# EAGLE board BKU (EAGLE 9.4.2)
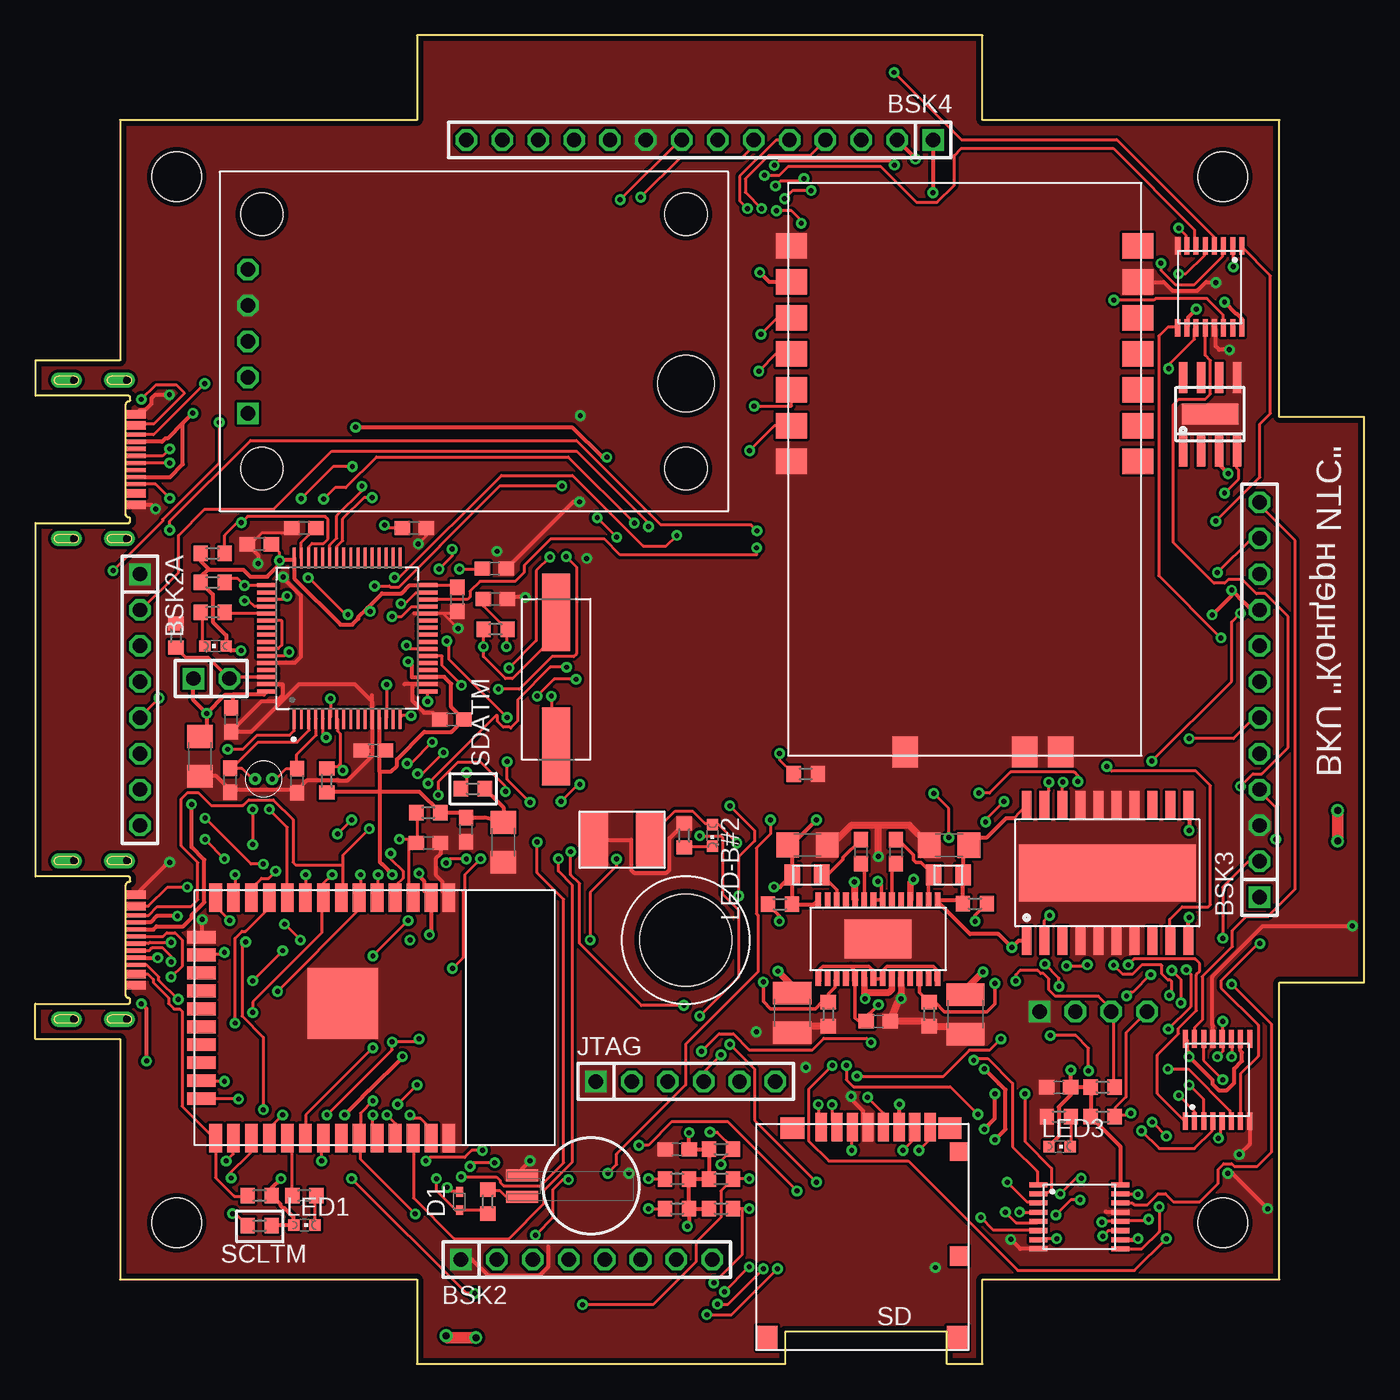
[diagram p2: board, top side]
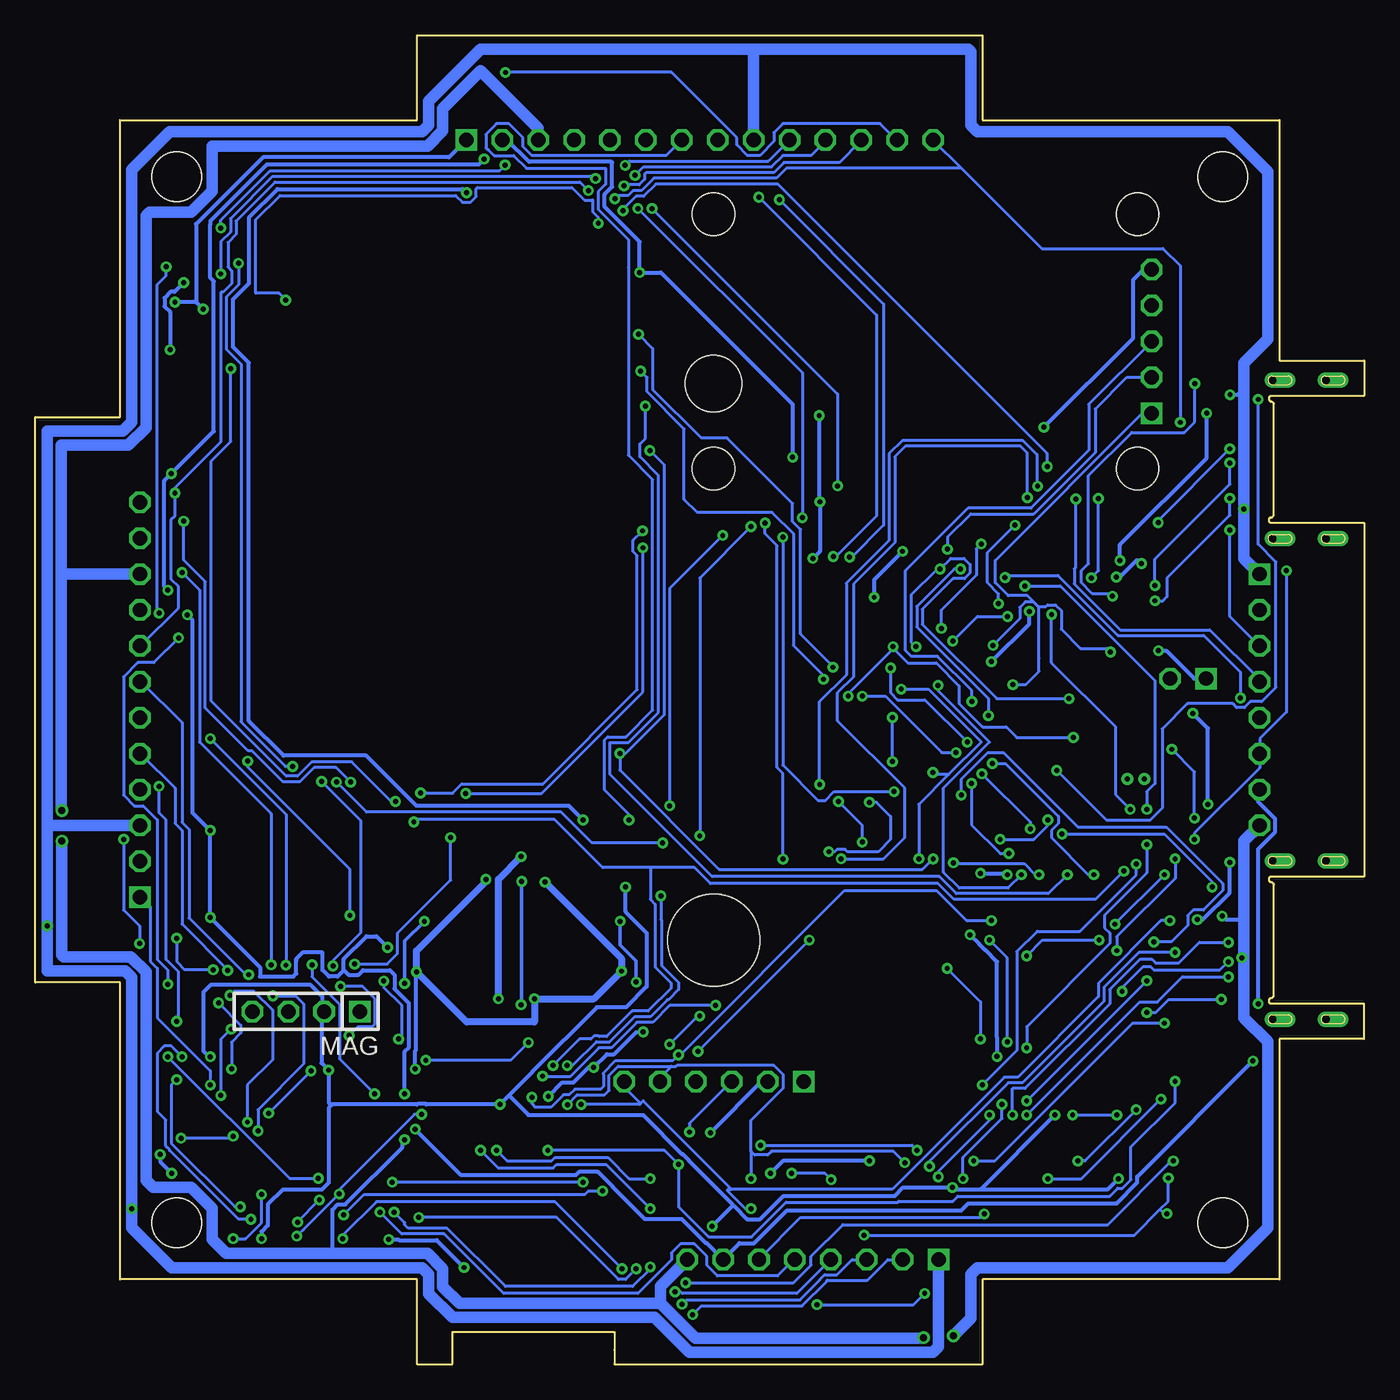
[diagram p3: board, bottom side, seen from below]

Size 94 x 94 mm. Coordinates in mm from the lower left corner, seen from the top.
Outline: 0,68.5 0,71 6,71 6,88 27,88 27,94 67,94 67,88 88,88 88,67 94,67 94,27 88,27 88,6 67,6 67,0 64.5,0 64.5,1
Outline: 0,59.5 0,34.5
Outline: 0,25.5 0,23 6,23 6,6 27,6 27,0 53.04,0 53.04,1
Copper layers (1*16): Top 0.035mm / dielectric 1.5mm / Bottom 0.035mm
Design rules "default *": minimum track width 0.2mm, minimum drill 0.35mm, track to track 0.2mm, track to pad 0.2mm, pad to pad 0.2mm, via to via 0.2mm, smd to smd 0.2mm, copper to edge 0.35mm, drill to drill 0.1mm, minimum pad ring 10mil, minimum via ring 8mil, stop-mask expansion 2mil, vias tented up to drill 0mil, thermal gap 10mil
Holes 3.5 mm at 10,10 84,84 10,84 84,10
Holes 6.5 mm at 46,30

## Footprints (pad centres in the part's own frame; a part is rotated, then mirrored left to right if it is on the bottom)
1X08 = drill 1.016 square: 1 -8.89,0 | drill 1.016 octagon: 2 -6.35,0; 3 -3.81,0; 4 -1.27,0; 5 1.27,0; 6 3.81,0; 7 6.35,0; 8 8.89,0
1X12 = drill 1.016 square: 1 -13.97,0 | drill 1.016 octagon: 2 -11.43,0; 3 -8.89,0; 4 -6.35,0; 5 -3.81,0; 6 -1.27,0; 7 1.27,0; 8 3.81,0; 9 6.35,0; 10 8.89,0; 11 11.43,0; 12 13.97,0
1X14 = drill 1.016 square: 1 -16.51,0 | drill 1.016 octagon: 2 -13.97,0; 3 -11.43,0; 4 -8.89,0; 5 -6.35,0; 6 -3.81,0; 7 -1.27,0; 8 1.27,0; 9 3.81,0; 10 6.35,0; 11 8.89,0; 12 11.43,0; 13 13.97,0; 14 16.51,0
BATTCON-6.8MM = smd 2.25 x 0.85: + 4.87,0.75; - 4.87,-0.75
C0603 = smd 1.1 x 1: 1 -0.85,0; 2 0.85,0
C1206 = smd 1.6 x 1.8: 1 -1.4,0; 2 1.4,0
C1210 = smd 1.6 x 2.7: 1 -1.4,0; 2 1.4,0
SOD523 = smd 0.7 x 0.5: A 0.7,0; C -0.6,0
GPS-NEO6M = drill 1.016 square: P$1 -5.08,16 | drill 1.016 octagon: P$2 -2.54,16; P$3 0,16; P$4 2.54,16; P$5 5.08,16 | hole 3: -9,15; 9,15; -9,-15; 9,-15 | hole 4: -3,-15
1X02 = drill 1.016 square: 1 -1.27,0 | drill 1.016 octagon: 2 1.27,0
1X06 = drill 1.016 square: 1 -6.35,0 | drill 1.016 octagon: 2 -3.81,0; 3 -1.27,0; 4 1.27,0; 5 3.81,0; 6 6.35,0
CHIPLED_0603 = smd 0.8 x 0.8: A 0,-0.75; C 0,0.75
1X04 = drill 1.016 square: 1 -3.81,0 | drill 1.016 octagon: 2 -1.27,0; 3 1.27,0; 4 3.81,0
XTAL_9C-8.000MEEJ-T = smd 5.5 x 2: 1 -4.75,0; 2 4.75,0
C005R = drill 0.35 pad 0.85: P$1 0,0.6; P$2 0,-0.6
R0603 = smd 1 x 1.1: 1 -0.85,0; 2 0.85,0
RADIO = smd 2.2 x 1.8: P$1 -24.75,20.8; P$2 -24.75,23.34; P$3 -24.75,25.88; P$4 -24.75,28.42; P$5 -24.75,30.96; P$6 -24.75,33.5; P$7 -24.75,36.04; P$8 -0.25,36.04; P$9 -0.25,33.5; P$10 -0.25,30.96; P$11 -0.25,28.42; P$12 -0.25,25.88; P$13 -0.25,23.34; P$14 -0.25,20.8 | smd 1.8 x 2.2: P$15 -5.73,0.25; P$16 -8.27,0.25; P$17 -16.73,0.25
SD = smd 0.8 x 2: CLK 6,-15.77; CMD 8.2,-15.77; DAT0 3.8,-15.77; DAT1 2.7,-15.77; DAT2 10.4,-15.77; DAT3 9.3,-15.77; VDD 7.1,-15.77; VSS 4.9,-15.77 | smd 1.5 x 1.7: P$9 0.75,-0.85; P$13 14.25,-0.85 | smd 1.6 x 1.5: P$10 1.3,-15.7 | smd 1.29 x 1.3: P$11 0.645,-14.05 | smd 1.29 x 1.4: P$12 0.645,-6.65 | smd 1.7 x 1.5: P$14 12.45,-15.7
QFP50P1200X1200X160-64N = smd 1.47 x 0.28: 1 -5.67,3.75; 2 -5.67,3.25; 3 -5.67,2.75; 4 -5.67,2.25; 5 -5.67,1.75; 6 -5.67,1.25; 7 -5.67,0.75; 8 -5.67,0.25; 9 -5.67,-0.25; 10 -5.67,-0.75; 11 -5.67,-1.25; 12 -5.67,-1.75; 13 -5.67,-2.25; 14 -5.67,-2.75; 15 -5.67,-3.25; 16 -5.67,-3.75; 33 5.67,-3.75; 34 5.67,-3.25; 35 5.67,-2.75; 36 5.67,-2.25; 37 5.67,-1.75; 38 5.67,-1.25; 39 5.67,-0.75; 40 5.67,-0.25; 41 5.67,0.25; 42 5.67,0.75; 43 5.67,1.25; 44 5.67,1.75; 45 5.67,2.25; 46 5.67,2.75; 47 5.67,3.25; 48 5.67,3.75 | smd 0.28 x 1.47: 17 -3.75,-5.67; 18 -3.25,-5.67; 19 -2.75,-5.67; 20 -2.25,-5.67; 21 -1.75,-5.67; 22 -1.25,-5.67; 23 -0.75,-5.67; 24 -0.25,-5.67; 25 0.25,-5.67; 26 0.75,-5.67; 27 1.25,-5.67; 28 1.75,-5.67; 29 2.25,-5.67; 30 2.75,-5.67; 31 3.25,-5.67; 32 3.75,-5.67; 49 3.75,5.67; 50 3.25,5.67; 51 2.75,5.67; 52 2.25,5.67; 53 1.75,5.67; 54 1.25,5.67; 55 0.75,5.67; 56 0.25,5.67; 57 -0.25,5.67; 58 -0.75,5.67; 59 -1.25,5.67; 60 -1.75,5.67; 61 -2.25,5.67; 62 -2.75,5.67; 63 -3.25,5.67; 64 -3.75,5.67
USB-C = smd 0.3 x 1.4: 3V3/BUS0 -1.25,7.1; 3V3/BUS1 1.25,7.1; NC/3V3 -0.75,7.1; NC/M1 0.75,7.1; RX0 -1.75,7.1; SWC/TXD 0.25,7.1; SWD/RXD -0.25,7.1; TX0 1.75,7.1 | smd 0.6 x 1.4: GND0 -3.2,7.1; GND1 3.2,7.1; NC/GPIO 2.4,7.1; NRST/EN -2.4,7.1 | drill 0.6 pad 1.1 offset: P$13 -5.6,6.5; P$14 -5.6,2.75; P$15 5.6,6.5; P$16 5.6,2.75
DS18B20Z = smd 0.6 x 2.2: 1 -1.905,-2.6; 2 -0.635,-2.6; 3 0.635,-2.6; 4 1.905,-2.6; 5 1.905,2.6; 6 0.635,2.6; 7 -0.635,2.6; 8 -1.905,2.6 | smd 4 x 1.5: HEAT 0,0
EM_HEAT = smd 2 x 4: 1 -2,0; 2 2,0
L293DD = smd 0.7 x 2: 1 -5.715,-4.8; 2 -4.445,-4.8; 3 -3.175,-4.8; 4 -1.905,-4.8; 5 -0.635,-4.8; 6 0.635,-4.8; 7 1.905,-4.8; 8 3.175,-4.8; 9 4.445,-4.8; 10 5.715,-4.8; 11 5.715,4.8; 12 4.445,4.8; 13 3.175,4.8; 14 1.905,4.8; 15 0.635,4.8; 16 -0.635,4.8; 17 -1.905,4.8; 18 -3.175,4.8; 19 -4.445,4.8; 20 -5.715,4.8 | smd 12.5 x 4: HEAT 0,0
LTC3633 = smd 0.4 x 1.05: 1 -4.225,-2.775; 2 -3.575,-2.775; 3 -2.925,-2.775; 4 -2.275,-2.775; 5 -1.625,-2.775; 6 -0.975,-2.775; 7 -0.325,-2.775; 8 0.325,-2.775; 9 0.975,-2.775; 10 1.625,-2.775; 11 2.275,-2.775; 12 2.925,-2.775; 13 3.575,-2.775; 14 4.225,-2.775; 15 4.225,2.775; 16 3.575,2.775; 17 2.925,2.775; 18 2.275,2.775; 19 1.625,2.775; 20 0.975,2.775; 21 0.325,2.775; 22 -0.325,2.775; 23 -0.975,2.775; 24 -1.625,2.775; 25 -2.275,2.775; 26 -2.925,2.775; 27 -3.575,2.775; 28 -4.225,2.775 | smd 4.75 x 2.74: HEAT 0,0
B82498F = smd 1.1 x 1.5: 1 -1.05,0; 2 1.05,0
ESP32WROOM = smd 2 x 0.9: 1 -8.5,5.26; 2 -8.5,3.99; 3 -8.5,2.72; 4 -8.5,1.45; 5 -8.5,0.18; 6 -8.5,-1.09; 7 -8.5,-2.36; 8 -8.5,-3.63; 9 -8.5,-4.9; 10 -8.5,-6.17; 11 -8.5,-7.44; 12 -8.5,-8.71; 13 -8.5,-9.98; 14 -8.5,-11.25; 25 8.5,-11.25; 26 8.5,-9.98; 27 8.5,-8.71; 28 8.5,-7.44; 29 8.5,-6.17; 30 8.5,-4.9; 31 8.5,-3.63; 32 8.5,-2.36; 33 8.5,-1.09; 34 8.5,0.18; 35 8.5,1.45; 36 8.5,2.72; 37 8.5,3.99; 38 8.5,5.26 | smd 0.9 x 2: 15 -5.715,-12.25; 16 -4.445,-12.25; 17 -3.175,-12.25; 18 -1.905,-12.25; 19 -0.635,-12.25; 20 0.635,-12.25; 21 1.905,-12.25; 22 3.175,-12.25; 23 4.445,-12.25; 24 5.715,-12.25 | smd 5.01 x 5.01: HEAT -1.01,-2.24
74HC595 = smd 1.26 x 0.36: 1 -2.9,2.275; 2 -2.9,1.625; 3 -2.9,0.975; 4 -2.9,0.325; 5 -2.9,-0.325; 6 -2.9,-0.975; 7 -2.9,-1.625; 8 -2.9,-2.275; 9 2.9,-2.275; 10 2.9,-1.625; 11 2.9,-0.975; 12 2.9,-0.325; 13 2.9,0.325; 14 2.9,0.975; 15 2.9,1.625; 16 2.9,2.275

## Placement (x,y rotation side)
BSK2  [1X08]  39,7.4 0 top
BSK2A  [1X08]  7.4,47 270 top
BSK3  [1X12]  86.6,47 90 top
BSK4  [1X14]  47,86.6 180 top
BT1  6.8MM_COIN_CELL  [BATTCON-6.8MM]  39.31,12.6 180 top
C1  0,1µ  [C0603]  60.88,36.24 90 top
C2  100nF  [C0603]  72.4,19.6 180 top
C3  10µ  [C1206]  33.11,36.92 270 top
C4  1nF  [C0603]  27.81,36.86 0 top
C5  0,1µ  [C0603]  58.4,36.24 270 top
C6  22µ  [C1206]  54.62,36.73 0 top
C7  27pF  [C0603]  32.53,54.13 0 top
C8  27pF  [C0603]  32.48,56.28 0 top
C9  2,2µ  [C0603]  26.8,59.15 180 top
C10  10pF  [C0603]  13.78,41.32 270 top
C11  10pF  [C0603]  18.51,41.28 270 top
C12  0,1µ  [C0603]  45.4,15.2 0 top
C13  2,2µ  [C0603]  19,59.15 0 top
C14  2,2µ  [C0603]  59.63,24.27 180 top
C15  22µ  [C1206]  64.64,36.72 180 top
C16  47µ  [C1210]  65.79,24.75 270 top
C17  47µ  [C1210]  53.54,24.85 270 top
C18  100nF  [C0603]  29.85,54.1 90 top
C19  10µ  [C1206]  11.65,43 90 top
C20  100nF  [C0603]  15.85,58 0 top
C33  0,1µ  [C0603]  30.46,37.82 270 top
C53  100nF  [C0603]  29.45,45.6 0 top
C54  100nF  [C0603]  13.85,45.6 90 top
C55  100nF  [C0603]  23.9,43.4 0 top
D1  BB141  [SOD523]  30,11.5 90 top
GPS  GPSNEO6M  [GPS-NEO6M]  31.03,72.35 90 top
JP1  [1X02]  12.45,48.5 0 top
JTAG  [1X06]  46,20 0 top
LED1  [CHIPLED_0603]  19.03,9.84 270 top
LED2  [CHIPLED_0603]  12.75,50.8 90 top
LED3  [CHIPLED_0603]  72.45,15.4 270 top
LED-B#2  [CHIPLED_0603]  47.9,37.4 180 top
MAG  [1X04]  74.84,24.95 180 bottom
Q1  8MHz  [XTAL_9C-8.000MEEJ-T]  36.84,48.44 270 top
Q2  32,768KHz  [C005R]  16.15,41.4 270 top
R1  10k  [R0603]  12.55,57.35 180 top
R2  2k  [R0603]  19.03,11.94 0 top
R3  10k  [R0603]  12.55,55.3 180 top
R4  620R  [R0603]  32,11.5 270 top
R5  12k  [R0603]  27.8,39.01 0 top
R6  5k1  [R0603]  15.87,11.94 0 top
R7  10k  [R0603]  20.61,41.28 270 top
R8  10k  [R0603]  56.1,24.76 270 top
R9  10k  [R0603]  63.23,24.76 270 top
R10  5k1  [R0603]  15.87,9.8 180 top
R11  5k1  [R0603]  30.95,40.7 180 top
R12  73,2k  [R0603]  66.46,32.57 180 top
R13  45,3k  [R0603]  52.67,32.53 0 top
R14  10k  [R0603]  9.95,51.55 90 top
R15  2k  [R0603]  12.55,53.2 180 top
R16  2k  [R0603]  72.4,17.5 0 top
R17  1M  [R0603]  32.55,52 0 top
R18  3k3  [R0603]  45.4,11 180 top
R21  3k3  [R0603]  45.4,13.1 180 top
R22  3k3  [R0603]  48.5,15.2 0 top
R23  3k3  [R0603]  48.5,13.1 0 top
R24  3k3  [R0603]  48.5,11 0 top
R25  5k1  [R0603]  75.5,19.6 0 top
R26  5k1  [R0603]  75.5,17.5 0 top
R27  2k  [R0603]  45.9,37.4 90 top
R29  10k  [R0603]  54.5,41.75 0 top
RADIO  RADIO  [RADIO]  78.25,43.05 0 top
SD  SD  [SD]  66,1 180 top
U1  STM32F405RGT6  [QFP50P1200X1200X160-64N]  22.07,51.35 90 top
U$4  USB-C  [USB-C]  0,64 270 top
U$5  DS18B20Z  [DS18B20Z]  83.09,67.2 0 top
U$6  USB-C  [USB-C]  0,30 270 top
U$7  EM_HEAT  [EM_HEAT]  41.5,37.1 180 top
U$8  L293DD  [L293DD]  75.83,34.75 0 top
U$10  LTC3633  [LTC3633]  59.62,30.07 0 top
U$11  1µH  [B82498F]  54.59,34.6 180 top
U$12  B82498F  [B82498F]  64.59,34.6 0 top
U$13  ESP32WROOM  [ESP32WROOM]  24,24.5 270 top
U$18  74HC595  [74HC595]  83.08,76.2 270 top
U$19  74HC595  [74HC595]  73.85,10.43 0 top
U$20  74HC595  [74HC595]  83.62,20.1 90 top

## Tracks (layer width: path | path; a pad name or v marks a point on that pad's centre or on a via)
1W  (via drill 0.35)
  Top 0.2: 23,16 23,14.5 v26.88,10.62 | U$5.4 85,63.38 85.12,63.25 85.12,62.62 v84.12,61.62 | v5.5,56.12 9,59.62 9,59.75 13,63.75 v13,66.62 | v54.88,83.03 53.58,83.03 v53,82.45 | 23,16 23,17.75 v23.88,18.62 | v17.5,29.25 v15.38,27.12 | v12,37.12 v13.38,35.75 | 23,16 U$13.33
  Bottom 0.2: v26.88,10.62 27.12,10.38 39.88,10.38 42.75,7.5 BSK2.6 | BSK3.8 86.5,50.88 83.88,53.5 83.88,55 84.38,55.5 84.38,59.75 84.12,60 v84.12,61.62 84.12,62 80.89,65.24 80.89,75.81 80.85,75.85 80.7,75.85 80.1,76.45 80.1,77.35 80.38,77.62 80.38,79.35 79.8,79.93 79.8,80.87 77.04,83.62 55.48,83.62 v54.88,83.03 | v5.5,56.12 5.5,46.12 7.38,44.25 7.38,43.25 BSK2A.6 7.4,42.17 12,37.58 v12,37.12 | v13,66.62 13,77.7 14.22,78.92 22.82,78.92 28.49,84.6 | 28.49,84.6 40.88,84.6 41.58,83.9 50.25,83.9 51.13,83.02 51.72,83.02 52.07,82.67 52.78,82.67 v53,82.45 | v15.38,27.12 v23.88,18.62 | v17.5,29.25 17.5,30.25 13.38,34.38 v13.38,35.75 | BSK4.14 28.49,84.6
5V  (via drill 0.35)
  Top 0.2: U$5.3 83.75,64.5 | 69.26,38.62 U$8.20
  Top 0.25: 65.64,32.6 R12.2
  Top 0.3: v67.12,16.62 67.42,16.93 67.42,16.94 67.88,17.39 v67.88,19.12 | U$8.1 69.55,29.95 v69.08,29.48 68.12,30.43 66.12,30.43 63.84,32.71 U$10.15 65.39,32.85 65.64,32.6 | R12.2 65.61,34.57 U$12.2 65.64,36.32 C15.1 66.59,37.27 67.33,37.27 68.68,38.62 69.26,38.62 | U$8.10 81.55,31.52 v81.62,31.6 | U$8.11 81.62,39.48 v81.62,37.75 | v83.25,53 84.62,54.38 v84.62,54.75 85.52,53.85 85.55,53.85 85.98,53.43 85.98,53.4 86.03,53.35 BSK3.9 | 83.75,64.5 83.75,63.62 v84.38,63 | BSK4.2 62.25,85.32 v62.25,85.25 | RADIO.P$6 51.92,76.55 v51.25,77.22 | v7.87,21.45 7.87,25.14 v7.5,25.5 | v40.43,64.16 40.1,64.16 38.01,66.25 22.65,66.25 v22.65,66.28
  Bottom 0.3: 72.19,27.89 71.85,27.55 71.14,27.55 70.83,27.86 68.91,27.86 68.6,27.55 68.6,26.55 67.58,25.52 67.58,22.43 67.88,22.12 v67.88,19.12 | v67.12,16.62 63.88,13.38 55.78,13.38 55.55,13.6 54.2,13.6 53.15,12.55 53.15,12.52 50.88,10.25 48.26,10.25 46.56,8.55 46.5,8.55 BSK2.7 44.2,8.55 43.15,8.55 40.83,10.88 28.5,10.88 28,11.38 17.51,11.38 17.51,11.39 16.05,12.85 16.05,13.26 v7.87,21.45 | 72.19,27.89 72.19,27.86 72.62,27.43 73.23,27.43 73.68,27.87 73.68,29.08 73.75,29.15 75.05,29.15 75.55,28.65 75.55,28.53 75.55,27.63 75.75,27.43 78.1,27.43 78.1,28.08 v81.62,31.6 81.67,31.65 81.67,37.7 v81.62,37.75 82.88,39 82.88,52.62 v83.25,53 | 72.19,27.89 72.19,28.66 70.57,30.27 69.88,30.27 v69.08,29.48 | v84.62,54.75 84.88,55 84.88,62.5 v84.38,63 81.38,66 81.38,76.59 81.62,76.84 81.62,80.62 81.6,80.65 81.6,80.88 77.61,84.88 62.62,84.88 v62.25,85.25 | BSK4.2 60.62,86.6 59.07,85.05 53.25,85.05 53.2,85 53.2,83.28 53.73,82.75 53.73,81.87 51.25,79.39 v51.25,77.22 49.75,77.22 40.43,67.9 v40.43,64.16 | BSK2A.7 7.5,40.55 7.5,39.78 6.29,38.57 6.29,37.65 7.5,36.44 v7.5,25.5 | v22.65,66.28 16.34,72.59 16.34,76.7 15.61,77.43 GPS.P$5
AUX  (via drill 0.35)
  Top 0.2: v25.12,36.12 25.12,35.75 26,34.88 26,34.38 25.5,33.88 25.5,33 U$13.4 | v37.58,49.3 36.42,49.3 34.12,47 34.12,45.5 33.62,45 33.55,45.07 33.09,45.07 32.7,45.47 32.7,45.83 32.61,45.91 v27.77,41.08 | v51.33,72.85 52.48,74 RADIO.P$5
  Bottom 0.2: v25.12,36.12 25.75,36.12 27.77,38.15 v27.77,41.08 | v37.58,49.3 37.58,49.35 39.88,51.65 39.88,59.04 40.43,59.59 40.43,60.88 45.06,65.51 46.89,65.51 50.33,68.95 50.33,71.85 v51.33,72.85
B1_KEM+  (via drill 0.35)
  Top 0.2: v84.75,77.62 84.75,79 U$18.2 | v85.25,53.12 84.62,52.5 84.62,48.3 v78.98,42.66 | v71.75,31.75 71.38,31.38 71.38,29.96 U$8.2
  Bottom 0.2: v84.75,77.62 84.75,77 85.38,76.38 85.38,53.25 v85.25,53.12 | v78.98,42.66 78.98,42.23 71.75,35 v71.75,31.75
B1_KEM-  (via drill 0.35)
  Top 0.2: v79.62,77.88 79.62,77.38 80.62,76.38 82,76.38 84,78.38 84,79 U$18.3 | v75.8,42.27 76.12,41.95 82.1,41.95 83.12,40.92 83.12,32.5 82.97,32.35 81.12,32.35 80.25,31.48 80.25,29.99 U$8.9
  Bottom 0.2: v75.8,42.27 76.3,42.27 79.47,45.45 79.45,45.47 79.45,70.75 80.49,71.79 80.49,75.5 79.62,76.36 v79.62,77.88
B1_KHEAT  (via drill 0.35)
  Top 0.2: v83.5,59.62 86.62,62.75 86.62,66.5 87.38,67.25 87.38,77 85.38,79 U$18.1 | v71.7,41.17 71.7,40.58 71.38,40.25 71.38,39.57 U$8.19
  Bottom 0.2: v83.5,59.62 83.5,56.88 81.97,55.35 81.97,46.42 78.93,43.38 78.67,43.38 76.49,41.2 75.29,41.2 74.28,42.2 72.72,42.2 v71.7,41.17
B2_KEM+  (via drill 0.35)
  Top 0.2: v66.88,10.38 67.75,9.5 70.88,9.5 U$19.6 | v51.5,6.75 49,4.25 v48.25,4.25
  Bottom 0.2: v66.88,10.38 57.12,10.38 52.75,6 52.25,6 v51.5,6.75 | v48.25,4.25 47.95,4.55 39.91,4.55 38.5,5.96 38.5,6 38.16,6.34 37.29,6.34 36.23,7.4 BSK2.3
B2_KEM-  (via drill 0.35)
  Top 0.2: v72.25,8.88 71,8.88 U$19.7 | v52.5,6.75 49.25,3.5 v47.5,3.5
  Bottom 0.2: v72.25,8.88 72.25,9.12 69.88,11.5 57.25,11.5 v52.5,6.75 | v47.5,3.5 46.88,4.12 39.76,4.12 38,5.88 38,5.93 38,5.94 35.15,5.94 33.69,7.4 BSK2.2
B2_KHEAT  (via drill 0.35)
  Top 0.2: v68.62,10.75 69.38,10 70.88,10 U$19.5 | v48.75,5.12 v50.5,6.88
  Bottom 0.2: v68.62,10.75 67.88,10 67.88,9.88 67.62,9.62 64.88,9.62 60.75,5.5 51.75,5.5 50.5,6.75 v50.5,6.88 | v48.75,5.12 48.38,5.12 48.25,5 40.12,5 37.75,7.38 BSK2.4
B2_KVCC  (via drill 0.35)
  Top 0.2: v69.62,10.75 U$19.4
  Bottom 0.2: v69.62,10.75 68.09,9.21 65.09,9.21 60.88,5 51.38,5 49,7.38 49,7.88 48.38,8.5 47.38,8.5 46.5,7.62 46.5,7 45.75,6.25 41.5,6.25 40.38,7.38 BSK2.5
B2A_KEM+  (via drill 0.35)
  Top 0.2: v70,19.12 70,15.75 71.88,13.87 71.88,12.38 71.62,12.12 71,12.12 U$19.2 | v72.95,28.18 74.34,28.18 v74.42,28.25 | v73.75,41.23 73.75,41.62 73.5,41.88 69,41.88 68.99,41.89 67.5,40.4 v66.75,40.4 | v9.5,59 9.5,59.62 15.22,65.35 38.27,65.35 44.25,59.38 50.62,59.38 v51.05,58.95
  Bottom 0.2: v70,19.12 72.47,21.6 72.47,25.45 74.42,27.39 v74.42,28.25 | v72.95,28.18 72.95,28.55 71,30.5 71,38.48 v73.75,41.23 | v9.5,59 9.5,52.88 7.5,50.88 BSK2A.3 | v51.05,58.95 51.71,58.29 51.71,57.47 51.43,57.19 51.43,47.72 58.1,41.05 63.83,41.05 64.48,40.4 v66.75,40.4
B2A_KEM-  (via drill 0.35)
  Top 0.2: v68.75,12.88 70.12,11.5 70.88,11.5 U$19.3 | v55.25,12.88 50.88,17.25 50.88,20.88 v49.12,22.62 | v47,24.62 49.75,27.38 49.75,32.12 48.62,33.25 48.62,37.25 48.5,37.38 v47,37.38 | v43.38,59.25 43.38,59.5 38.3,64.58 20.98,64.58 16.88,60.48 11.97,60.48 10.12,58.62 10.12,56 7.5,53.38 BSK2A.2
  Bottom 0.2: v55.25,12.88 v68.75,12.88 | v49.12,22.62 47.12,24.62 v47,24.62 | v47,37.38 47,55.62 v43.38,59.25
B2A_KHEAT  (via drill 0.35)
  Top 0.2: v66.38,21.5 66.5,21.62 67.38,21.62 69.12,19.88 69.12,15.38 70.88,13.62 70.88,12.75 U$19.1 | v59.12,22.75 58.82,23.05 55.78,23.05 54.98,22.25 50.5,22.25 49.38,23.38 48.38,23.38 v47.12,22.12 | v39.25,30 39.25,33.37 41.12,35.23 v41.12,35.73 | v42.38,59.5 37.7,64.17 24.12,64.17 21.95,62 21.2,62 v20.4,61.2
  Bottom 0.2: v66.38,21.5 60.38,21.5 v59.12,22.75 | v39.25,30 v47.12,22.12 | v42.38,59.5 42.38,58.75 41.52,57.9 41.52,42.21 41.12,41.8 v41.12,35.73 | v20.4,61.2 20.4,56.35 20.5,56.25 20.5,55.2 17.25,51.95 10.93,51.95 7.4,48.42 BSK2A.4
B2A_KVCC  (via drill 0.35)
  Top 0.2: v78,12 76.75,12 U$19.15 | v80,8.88 77.75,6.62 69.5,6.62 61.75,14.38 56.12,14.38 54.7,15.79 54.7,19.45 v56.38,21.12 | v49.75,33.12 49.75,35.88 50.88,37 50.88,37.75 v49.12,39.5 | v45.38,58.62 44.62,57.88 43,57.88 38,62.88 32.98,62.88 25.75,55.65 v25.4,55.65 | v8.75,47.12 7.38,45.75 BSK2A.5
  Bottom 0.2: v78,12 78,10 79.12,8.88 v80,8.88 | v56.38,21.12 56,21.12 54.31,22.81 54.27,22.77 53.42,22.77 51.61,24.58 50.49,24.58 49.29,25.77 49.23,25.77 48.5,26.5 48.5,27 49.7,28.2 49.7,31.39 49.75,31.44 v49.75,33.12 | v49.12,39.5 49.12,54.88 v45.38,58.62 | v8.75,47.12 8.75,48.95 11.35,51.55 17.42,51.55 21.67,55.8 25.25,55.8 v25.4,55.65
B3_KEM+  (via drill 0.35)
  Top 0.2: v80.12,20.88 81.55,20.88 84.5,17.92 84.5,17.25 U$20.6 | v81.05,25.56 81.05,27.2 v80.4,27.85
  Bottom 0.2: v80.4,27.85 80.4,27.9 83.62,31.12 83.62,37.75 84.12,38.25 84.12,40.75 86.5,43.12 BSK3.5 | v81.05,25.56 79.47,23.98 79.47,23.42 80.12,22.77 v80.12,20.88
B3_KEM-  (via drill 0.35)
  Top 0.2: U$20.7 85.25,20.54 86.5,21.79 86.5,24 83.88,26.62 83.88,27.12 86.5,29.75 v86.62,29.75 | v87.75,37.12 87.75,39.38 86.5,40.62 BSK3.4
  Bottom 0.2: v86.62,29.75 86.62,31 87.75,32.12 v87.75,37.12
B3_KHEAT  (via drill 0.35)
  Top 0.2: v83.69,15.98 83.88,16.16 83.88,17.12 U$20.5 | v79,17.12 v80,16.12 | v81.62,44.25 84.75,44.25 86.12,45.62 86.5,45.62 BSK3.6 | v76.28,28.23 76.93,27.57 77.61,27.57 78.28,28.25 79.65,28.25 79.7,28.2 79.7,27.59 80.12,27.17 80.28,27.17 80.35,27.1 80.35,26.21 v80.23,26.09
  Bottom 0.2: v83.69,15.98 80.14,15.98 v80,16.12 | v79,17.12 79,19.75 77.22,21.52 77.22,25.05 78.55,26.37 79.95,26.37 v80.23,26.09 | v76.28,28.23 76.28,38.9 v81.62,44.25
B3_KVCC  (via drill 0.35)
  Top 0.2: v78.25,16.5 79.5,15.25 82,15.25 83.25,16.5 83.25,17.12 U$20.4 | v77.19,26.05 77.44,26.3 77.62,26.3 78.88,27.55 v78.91,27.55
  Bottom 0.2: v78.25,16.5 78.25,18 75.03,21.23 75.03,25.48 75.59,26.05 v77.19,26.05 | v78.91,27.55 79.13,27.55 83.12,31.55 83.12,37.83 83.62,38.33 83.62,45.38 86.5,48.25 BSK3.7
B4_KEM+  (via drill 0.35)
  Top 0.2: v51.58,84.1 52.62,84.1 53.23,84.7 59.83,84.7 62.34,82.19 63.79,82.19 65,83.4 65,85.5 65.5,86 76.25,86 82,80.25 82,79.12 U$18.6
  Bottom 0.2: v51.58,84.1 50.98,84.7 41.92,84.7 41.12,85.5 39.12,85.5 38.12,86.5 BSK4.11
B4_KEM-  (via drill 0.35)
  Top 0.2: v80.88,80.38 81.38,79.88 81.38,79.12 U$18.7 | v60.77,84.83 60.5,85.1 52.58,85.1 v52.27,84.8
  Bottom 0.2: v80.88,80.38 80.88,80.92 77.38,84.42 61.17,84.42 v60.77,84.83 | v52.27,84.8 51.98,85.1 42.15,85.1 BSK4.10
B4_KHEAT  (via drill 0.35)
  Top 0.2: U$18.5 82.75,78.5 81.38,77.12 v80.88,77.12 | v54.38,83.88 54.17,83.67 52.67,83.67 v52.35,83.35
  Bottom 0.2: v80.88,77.12 80.88,79.42 80.2,80.09 80.2,81.04 77.21,84.03 54.52,84.03 v54.38,83.88 | BSK4.12 35.62,86.5 37.12,85 41.06,85 41.76,84.3 50.8,84.3 50.9,84.2 50.9,83.82 51.29,83.42 52.28,83.42 v52.35,83.35
B4_KVCC  (via drill 0.35)
  Top 0.2: v60.75,91.38 65.5,86.62 76.5,86.62 83.38,79.75 83.38,79.12 U$18.4
  Bottom 0.2: v60.75,91.38 49,91.38 44.38,86.75 44.38,86.25 43.62,85.5 42.75,85.5 41.75,86.5 41.75,87.12 41.12,87.75 34.25,87.75 33.12,86.62 BSK4.13
B5_KEM+  (via drill 0.35)
  Top 0.2: U$20.2 82,17.88 v80.88,19 | v81.42,27.9 81.72,27.6 81.72,25.27 v80.15,23.7 | v84,30.12 84,33.75 85.75,35.5 86.5,35.5 BSK3.2
  Bottom 0.2: v80.88,19 80.88,22.98 v80.15,23.7 | v84,30.12 84,28.48 83.42,27.9 v81.42,27.9
B5_KEM-  (via drill 0.35)
  Top 0.2: v81.62,19.75 82.62,18.75 82.62,17.25 U$20.3
  Bottom 0.2: v81.62,19.75 81.62,20.75 85.38,24.5 85.38,28 85.88,28.5 85.88,32.38 86.5,33 BSK3.1
B5_KHEAT  (via drill 0.35)
  Top 0.2: v83.62,56 86,58.38 86.5,58.38 BSK3.11 | U$20.1 81.25,17.25 79.38,19.12 79.38,21.88 80.87,23.37 80.87,23.75 82.13,25.01 82.13,27.56 82.36,27.79 82.36,28.34 82.05,28.65 77.72,28.65 v77.33,28.25
  Bottom 0.2: v77.33,28.25 77.33,38.95 82.38,44 82.38,54.75 v83.62,56
B5_KVCC
  Top 0.2: U$20.15 82,23.8 82.55,24.35 82.55,27.42 84.68,29.54 84.68,30.68 85.67,31.67 87.19,31.67 89.12,33.61 89.12,58.25 86.5,60.88 BSK3.12
BUS+  (via drill 0.35, 0.5)
  Top 0.25: U$10.6 58.64,27 58.72,26.93 58.72,26.3 | U$10.9 | U$10.18
  Top 0.3: v67.88,15.88 68.62,16.62 68.62,19.41 68.18,19.85 68.15,19.85 v67.12,20.88 | U$6.3V3/BUS1 v8.65,28.75 | U$6.3V3/BUS0 8.14,31.25 8.59,31.7 v10.05,31.7
  Top 0.45: U$10.6 58.64,25.9 | 60.59,26.5 U$10.9 | v62.13,34.29 61.9,34.06 U$10.18
  Top 0.5: C17.1 53.54,26.8 v52.54,27.8 | 58.64,25.9 v58.69,25.85 | 58.72,26.3 60.38,26.3 60.59,26.5 | C16.1 65.79,26.5 v67.04,27.75 | U$10.24 57.99,34.05 v57.94,34.1
  Top 0.8: v92.12,39.16 v92.12,37 | v31.16,1.88 29.18,1.88 v29.06,2
  Bottom 0.25: 58.69,24.2
  Bottom 0.3: 73,7.83 72.98,7.84 72.98,10.92 72.6,11.3 72.08,11.3 68.03,15.35 68.03,15.88 v67.88,15.88 | v67.04,27.75 67.08,27.71 67.08,22.22 67.12,22.17 v67.12,20.88 | v8.65,28.75 8.5,28.6 8.5,28 | v10.05,31.7 9.82,31.47 8.5,31.47
  Bottom 0.5: v62.13,34.29 62.13,34.16 67.04,29.25 v67.04,27.75 63.49,24.2 58.69,24.2 | v57.94,34.1 52.54,28.7 v52.54,27.8 54.49,25.85 v58.69,25.85 58.69,24.2
  Bottom 0.8: BSK4.3 58.43,87.43 62.5,91.5 65.17,88.83 65.17,87.24 66.24,86.17 81.5,86.17 81.5,82.96 82.96,81.5 85.92,81.5 86.17,81.25 86.17,66.24 87.42,65 92.17,65 92.17,56 | 92.17,56 92.06,55.89 BSK3.10 | 92.17,56 92.17,39.22 v92.12,39.16 | v92.12,37 92.12,28.95 92,28.83 87.24,28.83 86.17,27.76 86.17,13 85.67,12.5 82.96,12.5 81.5,11.04 81.5,8.83 80.5,7.83 73,7.83 66.24,7.83 65.17,6.76 65.17,5.47 64,4.3 49.79,4.3 | 49.79,4.3 47.31,1.83 31.22,1.83 v31.16,1.88 | v29.06,2 27.83,3.23 27.83,6.34 27.34,6.83 9.64,6.83 6.83,9.64 6.83,22.83 8.5,24.5 8.5,28 8.5,31.47 8.5,37.01 BSK2A.8 | BSK2.8 49.79,5.5 49.79,4.3
DAT0  (via drill 0.35)
  Top 0.2: v50.5,13.12 49.38,13.12 R23.2 48.5,12.25 48.5,10.38 46.75,8.62 46.75,7.25 43.71,4.21 v38.71,4.21 | v61.38,15.12 62.12,15.88 62.12,16.75 SD.DAT0 | v14.38,18.75 11.75,18.75 U$13.24 | v31.09,5 30.5,5 v22.38,13.12
  Bottom 0.2: v50.5,13.12 52,13.12 53.5,14.62 57.25,14.62 57.5,14.38 60.62,14.38 v61.38,15.12 | v14.38,18.75 20,13.12 v22.38,13.12 | v38.71,4.21 31.88,4.21 v31.09,5
DAT1  (via drill 0.35)
  Top 0.2: v50.5,11 50,11 | 50,11 R24.2 | v62.5,15.12 63.25,15.88 63.25,16.75 SD.DAT1 | v13.5,14.38 14,14.88 14,16 U$13.26 | v48,5.75 50,7.75 50,11
  Bottom 0.2: v50.5,11 53.62,14.12 57.12,14.12 57.38,13.88 61.25,13.88 v62.5,15.12 | v13.5,14.38 13.62,14.38 18.12,9.88 36.88,9.88 39.12,7.62 39.12,7 40.38,5.75 v48,5.75
DS  (via drill 0.35)
  Top 0.2: v22.43,63.5 21.07,63.5 v18.8,61.23 | v22.11,53.03 21.96,53.03 19.37,55.62 v19.3,55.62 | U$18.14 84,73.38 84,74.25 82.88,75.38 79.25,75.38 79.14,75.27 v76.29,75.27 | v52.42,81.6 53.48,81.6 54.18,80.9 v54.18,80.7 | U$13.10 17.83,37.97 v16.55,39.25
  Bottom 0.2: v52.42,81.6 52.42,81.7 51.5,82.62 50.96,82.62 50.11,83.47 41.48,83.47 22.43,64.42 v22.43,63.5 | v18.8,61.23 18.8,56.12 v19.3,55.62 | v22.11,53.03 22.11,49.61 17.6,45.1 17.6,40.3 v16.55,39.25 | v76.29,75.27 76.77,75.75 78.4,75.75 78.4,80.96 76.69,82.67 64.26,82.67 63.78,82.2 63.22,82.2 62.82,82.59 62.82,83.15 62.75,83.22 56.03,83.22 55.16,82.35 54.59,82.35 54.58,82.36 54.58,81.52 54.18,81.12 v54.18,80.7
EN  (via drill 0.35)
  Top 0.2: 27,37.12 27,39 R5.1 | 27,37.12 27,36.88 C4.1 | v22.38,38.5 v21.38,37.5 | 27,37.12 26.75,37.12 | 26.75,37.12 26.41,37.12 | 26.41,37.12 v25.75,37.12 | 27,37.12 C4.1 | U$13.3 26.41,33.31 26.41,37.12 | 26.75,37.12 C4.1 | U$6.NRST/EN 8,32.4 9.35,33.75 v10.75,33.75
  Bottom 0.2: v10.75,33.75 10.75,34.12 14.12,37.5 v21.38,37.5 | v22.38,38.5 22.38,38.12 23.38,37.12 v25.75,37.12
GND  (via drill 0.35)
  Top 0.2: C18.1 29.7,53.1 28.85,53.1 | 28.85,53.1 U1.28 | C13.1 17.8,58.8 16.03,58.8 15.23,58 C20.1 | 28.85,53.1 v29.9,52.05 | v27.09,58.02 27.65,58.59 C9.1
  Top 0.25: 56.31,36.73 C6.2 | 65.23,23.91 C16.2 | 54,23.91 C17.2
  Top 0.3: v9.49,68.57 8.47,68.57 8.23,68.33 8.23,67.95 7.8,67.52 7.42,67.52 U$4.GND0 | U$4.GND1 8.2,60.8 v8.5,60.5 | U1.12 23.82,47.32 | 26.1,48.1 U1.18 26.66,48.09 26.66,46.94 27.5,46.1 28.1,46.1 C53.1 | C8.2 38.05,61 v38.5,61 | C7.2 33.5,54.25 v34.66,54.25 | U$6.GND0 9.4,35.5 v9.5,35.5 | v11.8,31.45 11.75,31.4 U$13.15 | BSK2.1 30.91,7.4 32.02,6.29 35.7,6.29 36.3,6.89 36.3,8.3 | U$20.8 85.9,15.57 v85.17,14.83 | v84.35,13.5 84.67,13.5 v87.17,11 | U$19.8 69.67,8.15 v69,8.82 | U$19.13 75.78,10.75 75.75,10.78 75.72,10.78 | U$20.13 83.3,23.92 83.27,23.95 83.27,27.43 86.84,31 v93.17,31 | SD.VDD 58.55,17.12 58.55,17.91 57.71,18.75 v57.71,18.95 | BT1.- 34.44,13.82 v35,14.38 | U$7.2 42.15,37.1 42.15,34.95 42.35,34.75 44.65,34.75 44.85,34.95 44.85,37.2 R27.2 | C4.2 28.66,36.1 28.32,35.77 28.32,34.61 28.79,34.15 28.79,33.47 U$13.1 | U$18.13 83.5,73.2 83.5,72 83.74,71.76 v84.47,71.76 | v83.5,76.5 83.45,76.55 82.81,76.55 82.19,75.92 80.44,75.92 79.81,76.55 RADIO.P$9 | U1.28 26.8,53.1 | U1.63 17.48,48.1 17.48,47.29 17.06,46.86 15.96,46.86 C54.1 15.3,44.75 18.65,48.1 22.6,48.1 23.81,46.89 23.81,43.45 | 23.81,43.45 23.81,43.03 22.05,41.27 21.45,41.27 21.44,41.28 19.2,41.28 18.55,40.62 13.78,40.62 12.8,41.6 C19.1 | C20.1 15.75,57.25 v15.75,56.63 | v17.53,55.68 17.53,55.62 18.77,54.38 18.77,50.03 18.34,49.6 U1.60 | C55.1 23.76,43.4 23.81,43.45
  Top 0.45: v61.24,25.85 61.24,26.2 61.26,26.22 61.26,26.78 61.24,26.8 U$10.10
  Top 0.5: 56.31,36.73 57.69,38.1 59.64,38.1 | C15.2 61.84,38.12 59.64,38.12 59.64,38.1 | v61.24,25.85 61.03,25.64 C14.1 62.87,24.27 R9.2 65.23,23.91 | v59.64,35.9 59.64,38.1 | R8.2 54,23.91
  Bottom 0.2: v29.9,52.05 29.9,53.35 27.45,55.8 27.45,57.66 v27.09,58.02
  Bottom 0.3: v9.49,68.57 8.93,68.57 8.5,69 | v38.55,67.1 38.55,61.05 v38.5,61 38.5,57.5 v39,57 | v34.66,54.25 34.66,55.49 v32.65,57.5 | v11.8,31.45 11.41,31.45 9.55,33.31 9.55,35.45 v9.5,35.5 | v85.17,14.83 85.17,14.32 v84.35,13.5 | v69,8.82 68.33,8.82 68.28,8.77 65.6,8.77 v63.67,6.83 | v57.71,18.95 56.73,19.93 55.94,19.93 54.86,21 v54.5,21 53.58,21.93 53.06,21.93 51.49,23.5 v51,23.5 | v35,14.38 41.12,14.38 v42,13.5 | v83.5,76.5 84.15,75.85 84.43,75.85 84.85,75.43 84.85,74.82 84.47,74.44 v84.47,71.76 | v15.75,56.63 16,56.88 16.09,56.88 17.28,55.68 v17.53,55.68
  Bottom 0.5: v61.24,25.85 61.24,34.3 v59.64,35.9
  Bottom 0.8: BSK4.9 43.19,93 | 93.17,38.11 BSK3.3 | 93.17,38.11 v93.17,31 93.17,27.83 87.66,27.83 87.17,27.34 v87.17,11 87.17,9.64 84.36,6.83 66.66,6.83 66.17,6.34 66.17,4.97 64.5,3.3 50.2,3.3 47.73,0.83 30.5,0.83 30.11,1.22 BSK2.1 | 43.19,93 28,93 27.83,92.83 27.83,87.66 27.34,87.17 9.64,87.17 6.83,84.36 6.83,72.5 8.5,70.83 8.5,69 v8.5,60.5 8.5,56.99 BSK2A.1 | 43.19,93 62.5,93 66.17,89.33 66.17,87.66 66.66,87.17 84.5,87.17 87.17,84.5 87.17,66.66 87.83,66 93.17,66 93.17,38.11
  pour Top (isolate 0.2, no thermals): 6,88 27,88 27,94 67,94 67,88 88,88 88,67 94,67 94,27 88,27 88,6 67,6 67,0 27,0 27,6 6,6 6,23 0,23 0,71 6,71
I2CINT  (via drill 0.35)
  Top 0.2: v23.88,22.38 19.12,17.62 19.12,16 U$13.30 | v15.38,39.25 v15.38,36.75 | v37.25,62.12 32.85,62.12 28.62,57.9 28.62,57.88 25.72,54.97 25.12,54.97 25.04,55.05 v24,55.05 | v50.38,81.75 49.83,82.3 49.83,84.03 52.4,86.6 BSK4.5
  Bottom 0.2: v23.88,22.38 23.88,23.88 18,29.75 18,30.5 18.38,30.88 18.38,31.75 15.38,34.75 v15.38,36.75 | v15.38,39.25 15.38,40.5 14.8,41.08 14.8,48.34 21.5,55.05 v24,55.05 | v37.25,62.12 37.25,68.62 v50.38,81.75
IO0-E
  Top 0.2: 12.75,15.88 12.75,13.2 14.07,11.88 15,11.88 R6.1 | 12.75,15.88 10.38,18.25 10.38,24.96 10.21,25.12 9.82,25.12 9.42,25.52 9.42,25.91 8.34,27 8.34,27.22 7.96,27.6 U$6.NC/GPIO | 12.75,15.88 U$13.25
IO1
  Top 0.2: R2.1 18.12,12 18.12,15.75 17.88,16 U$13.29
M1  (via drill 0.35)
  Top 0.2: v17.12,26.38 22.88,32.12 22.88,33 U$13.6 23,33 v23,34.62 | R29.1 52.65,42.75 v52.65,43.2 | RADIO.P$2 52.29,66.39 v50.52,64.62 | v30.49,35.73 29.32,35.73 v29.05,35.47 | v9.6,28.47 9.63,28.82 9.02,29.43 8.24,29.43 8.07,29.25 U$6.NC/M1
  Bottom 0.2: v9.6,28.47 10.22,27.88 14.88,27.88 15.12,28.12 15.62,28.12 17.12,26.62 v17.12,26.38 | v50.52,64.62 49.52,63.62 49.52,45.92 52.25,43.2 v52.65,43.2 52.65,42.02 45.62,35 31.25,35 30.52,35.73 v30.49,35.73 | v23,34.62 23.25,34.62 24.04,35.41 29,35.41 v29.05,35.47
MTCK  (via drill 0.35)
  Top 0.2: v43.38,13.12 44.5,13.12 R21.2 | v13.38,29.12 13.25,29 11.75,29 U$13.16 | v30.75,14 31,14.25 v32.5,14.25 | v56.37,18.36 56.37,17.24 SD.DAT3
  Bottom 0.2: 43.38,15.06 43.38,17.25 41.12,19.5 41.12,20.5 41.75,21.12 48.62,21.12 48.69,21.06 48.7,21.07 49,21.07 | JTAG.5 49.75,20 49.75,20.32 49,21.07 | v30.75,14 30.75,14.38 30.71,14.38 25.18,19.9 24.17,19.9 18.4,25.67 18.4,26.67 15.94,29.12 v13.38,29.12 | v32.5,14.25 33.31,15.06 41.94,15.06 42.19,14.81 43.12,14.81 43.38,15.06 | v56.37,18.36 55.67,19.05 53.72,19.05 53.41,19.36 53.41,20.44 52.78,21.07 49,21.07 | 43.38,15.06 v43.38,13.12
MTDI  (via drill 0.35)
  Top 0.2: v43.38,11 R18.2 | U$13.14 12.75,32.38 v13.75,31.38 | SD.DAT2 55.38,16.98 v55.38,18.36
  Bottom 0.2: v43.38,11 43.75,11 45.06,12.31 45,12.38 44.74,12.38 | 51.19,18.44 52.25,19.5 52.25,20 JTAG.6 | 44.74,12.38 51,18.63 51.19,18.44 | v13.75,31.38 14.38,31.38 18.8,26.95 18.8,26 24.5,20.3 25.45,20.3 33.38,12.38 44.74,12.38 | v55.38,18.36 51.26,18.36 51.19,18.44
MTDO  (via drill 0.35)
  Top 0.2: v47.73,16.41 48.23,16.41 49.35,15.29 R22.2 49.25,15.12 48.5,14.38 v48.5,14.12 | v13.38,20 11.75,20 U$13.23 | v57.75,15.12 57.75,16.75 SD.CMD
  Bottom 0.2: v47.73,16.41 47.73,17.02 44.75,20 JTAG.3 | v13.38,20 13.38,18.5 16.5,15.38 16.5,13.04 17.09,12.45 17.43,12.45 18,11.88 28.75,11.88 29.1,11.53 32.92,11.53 32.99,11.46 40.88,11.46 43.34,9 46.38,9 48.5,11.12 v48.5,14.12 49.5,15.12 v57.75,15.12
MTMS  (via drill 0.35)
  Top 0.2: SD.CLK 60,17.75 v58.88,18.88 | v48.5,21.88 47.38,20.75 47.38,20 JTAG.4 | v14.12,34.62 14.12,33 U$13.13 | v18.75,30 v17.62,31.12 | v26.38,31.38 v23.88,28.88
  Bottom 0.2: v17.62,31.12 v14.12,34.62 | v18.75,30 22.75,30 v23.88,28.88 | v26.38,31.38 28.12,31.38 30.25,33.5 36.75,33.5 48.38,21.88 v48.5,21.88 48.9,21.48 52.94,21.48 53.81,20.61 53.81,20.5 53.81,19.64 54,19.45 55.83,19.45 56.23,19.05 56.65,19.05 57.52,18.18 58.62,18.18 58.88,18.43 v58.88,18.88
N$1
  Top 0.2: R4.1 32,12.25 32.88,12.25 33.25,11.88 34.38,11.88 BT1.+
N$2  (via drill 0.35)
  Top 0.2: 30,10.88 31.88,10.88 32,10.75 R4.2 | v16.12,35.38 15.25,35.38 v12,38.62 | v25.62,18.38 v27,19.75 | v28.38,13.12 28.38,12.25 29.75,10.88 30,10.88 | 30,10.88 D1.C | v13.61,43.5 14.68,43.5 15.68,44.5 18,44.5 18.32,44.82 U1.1
  Bottom 0.2: v16.12,35.38 16.12,34.62 20.12,30.62 23.12,30.62 24.57,29.18 24.57,22.18 v27,19.75 | v25.62,18.38 25.62,17.38 28.38,14.62 v28.38,13.12 | v12,38.62 12,41.89 v13.61,43.5
N$3  (via drill 0.35)
  Top 0.2: U$7.1 43.5,37.38 45.25,39.12 46.5,39.12 47.38,38.25 47.88,38.25 LED-B#2.A 48,38.25 48.25,38.25 v49.62,36.88 | v72.7,41.17 72.62,41.1 72.62,39.67 U$8.18
  Bottom 0.2: v72.7,41.17 70.58,39.05 56.8,39.05 54.62,36.88 v49.62,36.88
N$4
  Top 0.2: LED1.C 19.75,9.88 19.75,11.75 19.88,11.88 R2.2
N$5
  Top 0.25: U1.62 13.82,48.6 JP1.2 12.22,50 10.65,50 R14.1
N$6
  Top 0.2: U1.54 17.43,52.59 17.43,50.86 17.19,50.61 U1.58
N$7  (via drill 0.35)
  Top 0.2: U1.31 27.68,54.54 26.9,54.54 26.16,53.79 v25.86,53.79 | C9.2 24.9,59.15 v24.7,59.35
  Bottom 0.2: v25.86,53.79 25.86,54.49 26.65,55.27 26.65,57.4 v24.7,59.35
N$8
  Top 0.2: U1.47 18.82,58.12 C13.2
N$15  (via drill 0.35)
  Top 0.2: R17.1 v31.7,50.75 31.7,50.05 33.25,48.5 33.75,48.5 36.38,51.12 36.38,52.83 Q1.1 | v30,56.25 31.57,56.25 C8.1 | v20.88,47.08 20.88,45.77 U1.6
  Bottom 0.2: v31.7,50.75 32.05,51.1 32.05,54.4 30.2,56.25 v30,56.25 29.25,57 28.3,57 27.87,56.57 27.87,55.97 28.27,55.57 29.08,55.57 31.25,53.4 31.25,52.34 25.99,47.08 v20.88,47.08
N$17  (via drill 0.35)
  Top 0.2: v84.62,26.88 87.44,24.05 87.44,15 86.44,14 84.81,14 84.63,14.18 84.07,14.18 83.67,13.78 83.67,12.78 82.39,11.5 80.5,11.5 79.94,12.06 79.44,12.06 78.62,11.25 77.75,11.25 77.62,11.38 76.75,11.38 U$19.14 | v83.88,51.38 79.47,55.77 79.47,72.75 79.5,72.75 80.12,73.38 80.75,73.38 U$18.9
  Bottom 0.2: v84.62,26.88 84.62,27.88 85.38,28.62 85.38,38.5 86.38,39.5 87,39.5 87.75,40.25 87.75,48.62 86.75,49.62 85.62,49.62 v83.88,51.38
N$18  (via drill 0.35)
  Top 0.2: v79.5,11.12 79.5,9.38 78.25,8.12 76.75,8.12 U$19.9 | v84,20.12 82.62,21.5 82.62,23 U$20.14
  Bottom 0.2: v79.5,11.12 79.88,11.12 84.38,15.62 84.38,19.75 v84,20.12
N$24  (via drill 0.35)
  Top 0.25: U$10.14 63.84,27.25 63.72,27.12 63.72,27.96 63.52,28.15 60.26,28.15 59.97,27.86 59.97,27.23 59.94,27.25 | 59.94,27.25 U$10.8 | 57.67,28.15 57.87,27.96 57.87,27.12 U$10.5 57.99,24.51 58.2,24.3 | 57.67,28.15 55.7,28.15 55.52,27.96 55.52,27.12 55.39,27.25 U$10.1 | C14.2 58.2,24.3 | 57.67,28.15 58.98,28.15 59.34,27.79 59.34,27.35 U$10.7 59.34,27.25 59.94,27.25 | U$10.22 59.84,32.85 | 59.84,32.85 U$10.21 | 59.84,32.85 59.84,33.9 v59.59,34.15 | v59.64,25.43 58.52,24.3 58.2,24.3
  Bottom 0.25: v59.59,34.15 59.59,25.48 v59.64,25.43
N$25  (via drill 0.35)
  Top 0.25: v51.5,27.03 51.5,25.65 52.02,25.12 55.17,25.12 55.66,25.61 R8.1 56.1,26.18 56.56,26.64 56.56,27.18 U$10.3 | R13.1 52.63,31.72 v52.63,31.33
  Bottom 0.25: v52.63,31.33 52.63,29.66 51.5,28.53 v51.5,27.03
N$28
  Top 0.25: C5.1 57.15,35.84 57.15,35.7 56.05,34.6 U$11.1 56.69,33.55 U$10.26
N$30  (via drill 0.35)
  Top 0.2: 33.33,52 31.7,53.62 31.7,54.12 C7.1 | v20.57,44.33 20.38,44.52 20.38,45.65 U1.5 | 33.33,52 v33.33,50.75 | 33.33,52 R17.2 | v36.5,47.25 36.5,44.88 Q1.2
  Bottom 0.2: v20.57,44.33 24.57,44.33 25.32,45.08 27,45.08 28.65,46.73 28.65,47.98 30.27,49.6 32.27,49.6 33.33,50.65 v33.33,50.75 33.33,50.58 36.5,47.4 v36.5,47.25
N$31
  Top 0.25: C5.2 58.64,35.15 U$10.23
N$32
  Top 0.25: C1.1 60.59,35.1 U$10.20
N$33
  Top 0.25: U$10.16 63.19,34.25 U$12.1 62.65,35.49 62.3,35.49 62.12,35.69 62.12,36.02 61.05,37.09 C1.2
N$34
  Top 0.2: 13.88,42.12 14.62,42.12 15.25,41.5 15.5,41.5 Q2.P$2 | 13.88,42.12 15.75,44 18.52,44 19.38,44.85 19.38,45.65 U1.3 | 13.88,42.12 C10.1
N$35
  Top 0.2: Q2.P$1 16.75,41.5 17.12,41.5 17.75,42.12 C11.1 18.5,42.25 18.5,43.12 19.88,44.5 19.88,45.65 U1.4
N$37
  Top 0.2: LED2.C 11.8,51 11.8,53.2 R15.2
N$38
  Top 0.2: U1.53 13.5,53.1 R15.1
N$39  (via drill 0.35)
  Top 0.25: U$10.12 62.54,26.3 R9.1 63.62,25.61 64.31,24.93 67.31,24.93 67.87,25.49 v67.87,26.93 | R12.1 66.48,31.74 v66.48,31.33
  Bottom 0.25: v67.87,26.93 67.87,29.94 v66.48,31.33
N$40
  Top 0.2: R16.2 73.25,15.5 LED3.C
N$41  (via drill 0.35)
  Top 0.2: v26.57,45.88 25.93,45.88 U1.16 | v29.48,57.65 29.48,57.17 v28.55,56.25
  Bottom 0.2: v26.57,45.88 26.57,47.08 31.65,52.15 31.65,53.6 29,56.25 v28.55,56.25 | v29.48,57.65 29.48,58.5 27.82,60.15 23.38,60.15 19.02,64.5 19.02,67.56 16.78,69.81 GPS.P$2
N$42  (via drill 0.35)
  Top 0.2: v27.75,46.88 27.75,47.52 U1.17
  Bottom 0.2: GPS.P$3 19.48,67.91 19.48,64.65 23.57,60.55 28.02,60.55 32.45,56.12 32.45,50.49 32.03,50.07 30.17,50.07 27.75,47.65 v27.75,46.88
N$51
  Top 0.2: LED-B#2.C 47.88,36.62 46,36.62 R27.1
NRST  (via drill 0.35)
  Top 0.2: 21.44,42.31 21.57,42.45 21.57,44.6 21.38,44.8 21.38,45.65 U1.7 | 21.44,42.31 21.38,42.25 20.62,42.25 R7.1 | v7.5,68.25 8.5,69.25 10,69.25 10.56,68.69 8.38,66.5 7.12,66.5 U$4.NRST/EN | 21.44,42.31 v21.75,42
  Bottom 0.2: v7.5,68.25 7.5,58 6.25,56.75 6.25,47.88 7.25,46.88 8.04,46.88 8.47,46.45 9.03,46.45 9.31,46.73 12.5,46.73 14.29,44.94 14.29,39.34 15.12,38.5 18.25,38.5 v21.75,42
PL_KVCC  (via drill 0.35)
  Top 0.2: v19.12,34.62 19.12,33 U$13.9 | v28.07,44 26.57,42.49 v26.3,42.49 | v33.5,49.25 35.42,51.17 35.42,56.12 v36.4,57.1 | v41.38,82.38 45.62,86.62 BSK4.8
  Bottom 0.2: v19.12,34.62 19.5,34.62 22.12,37.25 22.12,37.75 21.62,38.25 21.62,38.75 25.36,42.49 v26.3,42.49 | v28.07,44 31.07,47 33,47 33.5,47.5 v33.5,49.25 | v36.4,57.1 36.25,57.1 34,59.35 34,75 v41.38,82.38
RX-E  (via drill 0.35)
  Top 0.2: v9.6,27.4 10.38,28.12 10.38,30.02 9.88,30.52 9.3,30.52 9.04,30.25 U$6.SWD/RXD | v23.88,17.62 23.88,16.25 24.12,16 U$13.34
  Bottom 0.2: v9.6,27.4 12.85,27.4 14.62,25.62 15.88,25.62 v23.88,17.62
RX-ES  (via drill 0.35)
  Top 0.2: v23.82,61.3 23.25,61.3 21.75,59.8 21.75,58.25 21.32,57.82 U1.42 | v37,35.75 37,34.88 38,33.88 38,14.31 36,12.31 36,11.38 33.5,8.88 29.62,8.88 26.75,11.75 26.75,16 U$13.36
  Bottom 0.2: v37,35.75 34,35.75 32.5,37.25 32.5,40.75 37.25,45.5 37.25,47.5 36.12,48.62 36.12,55.18 33.2,58.11 33.2,64.2 32.45,64.95 24.32,64.95 23.88,64.5 23.88,61.35 v23.82,61.3
RX-R  (via drill 0.35)
  Top 0.2: 21.75,35.3 21.75,36 v23.62,37.88 | 21.75,35.3 21.75,33 U$13.7 | v28.87,43.26 27.37,41.76 v27.04,41.76 | v35.5,47.25 36.7,48.45 v38.25,48.45 | RADIO.P$4 52.4,71.47 v51.17,70.25 | U$6.RX0 8.01,31.75 8.63,32.38 11.02,32.38 11.5,32.86 11.5,35.49 10.32,36.67 10.32,39.98 10.77,40.43 11.53,40.43 12.43,39.53 14.7,39.53 15.09,39.93 16.83,39.93 18.23,38.53 18.23,35.5 18.43,35.3 18.84,35.3 21.28,35.3 21.75,35.3
  Bottom 0.2: v23.62,37.88 23.62,38.34 v27.04,41.76 | v28.87,43.26 29.89,43.26 33.88,47.25 v35.5,47.25 | v38.25,48.45 38.15,48.55 38.15,48.62 40.38,50.85 40.38,58.75 41.88,60.25 47.17,60.25 48.1,61.17 48.1,66.16 50.73,68.78 50.73,69.8 v51.17,70.25
RX-S  (via drill 0.35)
  Top 0.2: U$4.RX0 8.37,65.75 v11.98,69.36 | v17.8,54.33 17.57,54.1 U1.51
  Bottom 0.2: v11.98,69.36 11.98,66.64 12.72,65.9 16.45,65.9 19.5,62.85 19.5,56.62 20,56.12 20,55.27 19.25,54.52 17.8,54.52 v17.8,54.33
SCL  (via drill 0.35)
  Top 0.2: R25.2 76.25,19.62 76.25,24.81 MAG.3 76.11,25.11 75.2,26.02 72.14,26.02 71.7,26.46 71.7,27.25 71.32,27.63 71.13,27.63 70.91,27.85 69.65,27.85 69.35,27.55 v69.35,27.1 | v33.38,45.75 29.24,49.89 29.24,51.01 v29.1,51.15 | v33.38,42.62 33.38,41.38 v35,39.75 | v37.88,36.25 37.88,34.62 38.5,34 38.5,29.75 42.88,25.38 v45.88,25.38 | v58.12,20.38 64.25,20.38 66.08,22.2 67.5,22.2 v68.3,23 | v25.22,52.89 25.92,52.89 26.58,53.55 27.69,53.55 U1.29
  Bottom 0.2: v33.38,42.62 v33.38,45.75 | v35,39.75 34.5,39.75 33.5,38.75 33.5,37.12 34.38,36.25 36.54,36.25 36.72,36.43 37.28,36.43 37.46,36.25 v37.88,36.25 | v58.12,20.38 56.12,20.38 54.12,22.38 53.25,22.38 51.45,24.18 50.32,24.18 49.12,25.38 v45.88,25.38 | v69.35,27.1 69.35,26.65 68.1,25.4 68.1,22.7 68.25,22.85 68.25,22.95 v68.3,23 | v29.1,51.15 27.36,52.89 v25.22,52.89
SCLTM  (via drill 0.35)
  Top 0.2: v13.86,13.16 13.63,13.38 15.25,15 15.25,16 U$13.27 | v35.38,9.12 36.62,10.38 36.62,12.37 37.31,13.05 v37.7,13.05 | v52,38.5 52,37.5 51,36.5 51,31.88 51.12,31.75 51.12,27.75 46,22.62 46,19.75 41.12,14.88 41.12,14.12 v40.5,13.5 | v13.95,10.65 14.17,10.65 R10.2
  Bottom 0.2: v13.86,13.16 13.86,11.52 14.44,10.94 | 14.44,10.94 16.25,9.12 v35.38,9.12 | v52,38.5 52,38.88 53.75,40.62 53.75,44.14 53.52,44.38 52.22,44.38 50.33,46.27 50.33,62.57 52.05,64.3 52.05,77.58 52.05,79.56 54.18,81.69 54.18,82.94 53.65,83.47 53.65,84.6 59.26,84.6 60.16,85.5 61.54,85.5 61.97,85.93 62,85.93 62.12,86.05 62.12,87 61.38,87.75 60.5,87.75 59.5,86.75 59.5,86.12 58.88,85.5 49.38,85.5 48.38,86.5 BSK4.7 | v37.7,13.05 38.15,13.5 v40.5,13.5 | 14.44,10.94 14.15,10.65 v13.95,10.65
SDA  (via drill 0.35)
  Top 0.2: 76.38,17.62 76.38,18.12 77.15,18.9 77.15,23.45 MAG.4 | 76.38,17.62 76.38,17.5 R26.2 76.38,17.62 | v72.42,26.73 72.42,27.3 v71.41,28.3 | v74.5,20.75 74.5,22.35 73.6,23.25 v71.8,23.25 | v77.5,17.75 77.38,17.62 76.38,17.62 | v64.62,37.25 64.62,39.3 v63.55,40.37 | v51.03,57.75 51.03,57.25 41.38,57.25 40.25,58.38 36.45,58.38 34.58,56.5 34.58,56 33.95,55.38 31.45,55.38 30.75,54.67 30.75,54.28 30.57,54.1 U1.30
  Bottom 0.2: v64.62,37.25 64.62,34.25 68.38,30.5 68.38,29.04 69.11,28.3 v71.41,28.3 | v77.5,17.75 v74.5,20.75 | v63.55,40.37 58.21,40.37 51.03,47.55 v51.03,57.75 | v71.8,23.25 71.16,23.89 70.14,23.89 69.97,24.06 69.97,25.84 70.86,26.73 v72.42,26.73
SDATM  (via drill 0.35)
  Top 0.2: v17.5,17.62 16.62,16.75 16.62,16 U$13.28 | v31.5,35.75 30.38,34.62 30.38,33.56 30.25,33.43 30.25,28.75 v29.5,28 | v32.75,47.75 34.25,47.75 36.55,50.05 38.08,50.05 38.27,50.25 38.27,56.4 v37.55,57.12 | v42.83,82.55 45.62,85.35 49.98,85.35 50.75,86.12 50.75,86.5 BSK4.6 | v20.62,17.62 25.25,22.25 v25.25,22.79 26.93,22.79 v27.14,23 | v30.5,41.85 30.5,41.1 R11.2
  Bottom 0.2: v20.62,17.62 v17.5,17.62 | v31.5,35.75 31.5,39.61 29.41,41.7 | 29.41,41.7 27.09,44.02 30.82,47.75 v32.75,47.75 | v37.55,57.12 37.38,57.12 34.5,60.01 34.5,74.22 v42.83,82.55 | v25.25,22.79 25.25,28.75 v26.5,30 | v29.5,28 27.14,25.64 v27.14,23 | 29.41,41.7 30.36,41.7 v30.5,41.85
SHCP  (via drill 0.35)
  Top 0.2: v73.98,13.15 73.61,13.15 v72.5,12.04 | v84.62,21.75 84.62,23 U$20.11 | v80.17,70.42 80.05,70.55 82,72.5 82,73.25 U$18.11 | v68.53,39.8 67.17,38.45 67.17,38.4 v67.22,38.35 | v17,34.88 16.5,34.38 16,34.38 15.38,33.75 15.38,33 U$13.12 | v66.67,17.68 64.72,19.62 57.88,19.62 57.38,20.12 v57.38,21.12 | U$19.11 75.89,9.45 v75.5,9.06
  Bottom 0.2: v75.5,9.06 75.04,9.5 v72.5,12.04 72.5,12.35 67.17,17.68 v66.67,17.68 | v73.98,13.15 76.03,13.15 v84.62,21.75 | v67.22,38.35 67.03,38.55 57.3,38.55 53.88,35.12 50.5,35.12 | 50.5,35.12 47.38,35.12 46.25,34 30.14,34 29.01,32.88 19,32.88 v17,34.88 | v57.38,21.12 55.5,23 54.69,23 54.48,23.21 54.15,23.21 54.11,23.18 53.58,23.18 51.78,24.98 50.65,24.98 49.03,26.6 49.03,26.97 50.15,28.08 50.15,32.52 50.5,32.88 50.5,35.12 | v68.53,39.8 68.83,39.8 71.62,42.6 74.45,42.6 75.45,41.6 76.25,41.6 81.58,46.92 81.58,63.88 80.17,65.28 v80.17,70.42
STCP  (via drill 0.35)
  Top 0.2: v78.75,10.25 78.62,10.12 76.75,10.12 U$19.12 75.5,10.1 v75.45,10.05 | v83.62,21.75 84,22.12 84,23 | U$18.12 82.75,71.38 83.12,71 83.12,68.62 82.75,68.25 80.88,68.25 80.5,67.88 80.5,58.12 83.38,55.25 84.12,55.25 84.38,55.5 85.38,55.5 86.38,54.5 87,54.5 88.62,52.88 88.62,43.62 86.75,41.75 86.12,41.75 v85.25,40.88 | 84,23 v84,24.25 | 84,23 U$20.12 | v14.12,24.12 14.12,30.12 14.62,30.62 14.88,30.62 16.5,32.25 16.5,33 U$13.11 | v27.62,14.38 27.88,14.62 30.38,14.62 30.88,15.12 v31.62,15.12 | v42.7,15.48 43.36,15.48 45,17.12 49,17.12 v53.88,12.25 | v73.91,11.61 73.25,11.61 v72.19,10.55
  Bottom 0.2: v78.75,10.25 79.62,10.25 84.5,15.12 84.5,15.18 84.78,15.46 84.78,17.27 85.38,17.87 85.38,22 84.88,22.5 84.38,22.5 v83.62,21.75 | v85.25,40.88 85.25,39 84.75,38.5 84.75,28.62 83.88,27.75 83.88,24.38 v84,24.25 | v14.12,24.12 16.38,24.12 26.12,14.38 v27.62,14.38 | v42.7,15.48 31.98,15.48 v31.62,15.12 | v53.88,12.25 54.88,12.25 55.12,12 70.74,12 v72.19,10.55 | v75.45,10.05 75.45,10.07 v73.91,11.61
SWC  (via drill 0.35)
  Top 0.2: U1.49 16.38,55.08 v14.8,55.08 14.3,55.58 13.12,55.58 R3.1 | v9.5,63.75 U$4.SWC/TXD
  Bottom 0.2: v9.5,63.75 9.5,62.25 14.8,56.95 v14.8,55.08
SWD  (via drill 0.35)
  Top 0.2: U$4.SWD/RXD 9,64.25 v9.5,64.75 | R1.1 13.4,58.65 14.28,59.53 v14.57,59.53 15,59.96 20.51,59.96 20.7,59.77 20.7,58.38 20.38,58.05 19.58,58.05 19.32,57.8 U1.46
  Bottom 0.2: v9.5,64.75 14.64,59.6 v14.57,59.53
TIME  (via drill 0.35)
  Top 0.2: v20.25,14.38 20.25,16 U$13.31 | v16.12,18 16.12,23.12 14.62,24.62 14.62,29.62 v14.88,29.88 | v28.5,40.25 28.5,41.2 29.88,42.58 31.52,42.58 33.25,40.85 v33.25,40.5 | v39.75,59.88 v41.12,58.5 | BSK4.4 54.79,85.5 51.88,85.5 50.23,83.85 50.23,82.9 v51.38,81.75
  Bottom 0.2: v20.25,14.38 19.75,14.38 v16.12,18 | v14.88,29.88 13.62,29.88 12.48,31.02 12.48,31.73 12.08,32.13 11.37,32.13 10,33.5 10,34 14,38 20.25,38 25.52,43.27 26.63,43.27 28.5,41.4 v28.5,40.25 | v33.25,40.5 37.5,40.5 38.12,39.88 38.62,39.88 41.12,42.38 v41.12,58.5 | v39.75,59.88 39.75,70.12 v51.38,81.75
TIME-ES  (via drill 0.35)
  Top 0.2: v24.25,34.62 24.25,33 U$13.5 | v30.14,48.02 30.14,48.05 28.77,49.41 28.77,50.09 U1.22
  Bottom 0.2: v24.25,34.62 25.19,33.69 28.64,33.69 29.75,34.79 29.75,40.76 26.5,44.01 30.14,47.64 v30.14,48.02
TIME-G  (via drill 0.35)
  Top 0.2: v24.86,48.07 24.86,45.74 U1.14 | v17.94,50.38 17.89,50.38 17.61,50.1 U1.59 | U1.23 26.5,50.6 v26.25,50.85
  Bottom 0.2: GPS.P$1 15.68,67.27 26.1,56.85 26.1,55.29 25.18,54.37 23.81,54.37 23.01,53.57 | v24.86,48.07 23.93,48.07 23,49 23,49.93 23.01,49.94 23.01,53.57 | v17.94,50.38 18.19,50.63 20.07,50.63 21.43,51.99 21.43,53.32 21.83,53.71 22.39,53.71 22.54,53.57 23.01,53.57 | v26.25,50.85 24.36,52.73 24.36,53.53 23.97,53.93 23.41,53.93 23.05,53.57 23.01,53.57
TX-E  (via drill 0.35)
  Top 0.2: v24.88,17.62 25.5,17 25.5,16 U$13.35 | U$6.SWC/TXD 8,29.75 8.09,29.84 v9.6,29.84
  Bottom 0.2: v9.6,29.84 11.66,29.84 13.12,28.38 14.75,28.38 15,28.62 15.88,28.62 18,26.5 18,25.5 24,19.5 24.88,19.5 v24.88,17.62
TX-ES  (via drill 0.35)
  Top 0.2: v23.1,62.1 23.1,61.8 21.32,60.02 21.32,58.43 20.82,57.93 U1.43 | v30.12,13.25 32.62,13.25 32.88,13 32.88,12.88 33.12,12.62 35.75,12.62 37.38,14.25 37.38,32.88 35.5,34.75 v35.5,36.93 | v26.5,17.62 26.75,17.38 27.25,17.38 27.88,16.75 27.88,16 U$13.37 | v37.19,39.8 38.4,41.01 v38.52,41.01
  Bottom 0.2: v23.1,62.1 23.15,62.15 23.15,64.35 24.15,65.35 32.65,65.35 33.6,64.4 33.6,58.27 36.62,55.25 36.62,48.75 38.52,46.86 v38.52,41.01 | v30.12,13.25 30.12,13.62 26.5,17.25 v26.5,17.62 | v35.5,36.93 35.5,38.11 v37.19,39.8
TX-R  (via drill 0.35)
  Top 0.2: v15.38,24.88 15.38,25.62 20.25,30.5 20.25,33 U$13.8 20.38,34 v21,34.62 | v50.85,67.78 53.5,67.78 RADIO.P$3 | v10.1,25.8 8.74,27.16 8.74,27.39 7.87,28.25 U$6.TX0
  Bottom 0.2: v10.1,25.8 13.82,25.8 14.75,24.88 v15.38,24.88 | v50.85,67.78 50.85,65.47 51.24,65.09 51.24,64.19 49.92,62.88 49.92,46.1 52.05,43.98 53.35,43.98 53.35,41.73 46.12,34.5 30.06,34.5 28.84,33.28 22.34,33.28 v21,34.62
TX-S  (via drill 0.35)
  Top 0.2: U$4.TX0 8.5,62.25 v9.5,61.25 | v14.8,54 15.1,54 15.5,53.6 U1.52
  Bottom 0.2: v9.5,61.25 9.5,60.05 13.95,55.6 13.95,54.3 14.25,54 v14.8,54
VDD  (via drill 0.35)
  Top 0.2: U$18.10 81.5,73.38 | U$18.16 85.38,73.38 | 47.62,15.25 R22.1 | 47.62,13.12 R23.1 | v29.12,12.5 29.38,12.25 30,12.25 D1.A | 18.25,9.88 LED1.A | 74.62,19.62 R25.1 | SD.VSS 61.12,16.88 | C6.1 53.38,36.62 | U1.32 29.7,55.1 C18.2 | v17.27,56.85 17.27,57.42 C20.2 | 73.38,19.62 73.25,19.62 C2.1 73.38,19.62
  Top 0.3: v12.12,46.04 13.44,47.36 13.95,47.36 | v26.37,49.69 26.62,49.44 26.62,48.6 U1.19 28.93,48.61 29.41,48.13 29.41,46.49 C53.2 29.43,44.73 27.51,44.73 25.58,42.79 25.58,42.33 25.18,41.93 24.32,41.93 | 23.5,53.5 22.84,52.84 22.84,52.73 22.41,52.31 21.59,52.31 18.32,55.58 U1.48 18.2,56.9 17.32,56.9 | 23.5,53.5 24.52,54.52 25.91,54.52 26.49,55.1 U1.32 | v23.69,53.25 23.5,53.44 23.5,53.5 | BSK4.1 v63.51,82.89 v63.5,82.88 | 53.38,36.62 v55.25,38.5 | C6.1 53.54,36.41 U$11.2 | U$11.2 53.54,32.55 R13.2 55.07,32.53 U$10.28 | U$11.2 52.69,33.75 v52.25,33.75 | 61.12,16.88 v61.12,18.38 | v17.38,13.12 16.72,12.47 R6.2 17.33,11.33 17.33,11.24 17.54,11.04 17.62,11.04 18.25,10.41 18.25,9.88 16.8,9.88 R10.1 | v25.96,21.77 25.96,21.71 23.6,19.35 23.57,19.35 23.15,18.93 23.15,18.9 v21.88,17.62 | v27.88,30.38 27.99,30.49 U$13.2 27.52,33.47 27.52,34.15 27.14,34.52 v27.14,34.73 | v25.25,34.62 24.98,34.9 24.98,34.93 24.55,35.35 24.52,35.35 24.38,35.5 24.38,40.5 | U1.13 24.32,43.45 | 24.32,43.45 24.32,41.93 | 24.38,40.5 27.16,40.5 R5.2 30.12,39.01 C33.1 31.74,38.67 C3.1 33.11,39.39 R11.1 | R7.2 20.68,40.5 24.38,40.5 | 24.38,40.5 24.38,41.88 24.32,41.93 | R18.1 46.25,9.88 v46.12,9.75 | R18.1 R24.1 | R18.1 R21.1 R23.1 | 47.62,15.25 47.58,15.2 C12.2 v46.25,16.38 | U$19.10 77.92,8.8 v78,8.88 | C2.1 73.25,19.05 72.4,18.2 72.4,16.1 LED3.A | C2.1 73.28,19.62 74.62,19.62 | R25.1 R26.1 76.75,15.4 U$19.16 | U$20.16 81.47,22.88 81.47,22.23 81.62,22.07 v81.62,21.75 83.27,20.1 83.27,19.82 83.72,19.38 84.28,19.38 84.8,19.89 84.8,20.89 85.35,21.45 85.35,22.05 85.25,22.16 U$20.10 | v84.12,75.12 84.97,74.28 85.03,74.28 85.38,73.93 85.38,73.38
  Top 0.3: 81.5,73.38 81.55,73.42 81.55,74.06 81.78,74.28 v82.12,74.62 | U$4.3V3/BUS0 8.97,65.25 9.2,65.48 9.35,65.48 10.44,66.56 | v11.14,67.26 10.44,66.56 | U$4.3V3/BUS1 9.53,62.75 10.44,63.66 10.44,66.56 | 17.32,56.9 v17.27,56.85 | 12.25,56.25 12.3,56.2 14.71,56.2 15.21,55.7 16.4,55.7 17.32,56.62 17.32,56.9 | 12.25,56.25 11.7,56.8 R1.2 | 12.25,56.25 11.7,55.7 R3.2 12.55,54.45 12.55,52.51 13.5,51.55 LED2.A 13.83,50.47 v14.55,50.47 | 13.95,47.36 16.16,47.36 U1.64 | U$6.NC/3V3 8.35,30.75 8.57,30.97 10.47,30.97 11.07,31.57 11.07,31.79 11.95,32.67 11.95,35.67 11.05,36.58 v11.05,39.6 | R22.1 47.65,13.15 47.62,13.12 | v12.12,46.04 11.18,46.98 JP1.1 | C2.1 v73.25,20.8 | 13.95,47.36 13.95,46.55 C54.2 | v12.12,46.04 12.12,44.87 C19.2 | C55.2 24.37,43.4 24.32,43.45
  Bottom 0.3: v11.05,39.6 11.05,44.97 v12.12,46.04 | v26.37,49.69 23.69,52.37 v23.69,53.25 | v63.5,82.88 63.75,83.12 76.88,83.12 78.9,81.1 78.9,78.18 78.9,76.45 80.04,75.31 80.04,71.97 78.9,70.84 78.9,45.51 76.44,43.05 70.59,43.05 67.05,39.5 56.25,39.5 v55.25,38.5 | v52.25,33.75 52.25,32 50.75,30.5 50.75,26.71 52.21,25.25 54.28,25.25 58.85,20.68 58.85,20.65 60.5,19 | 60.5,19 v61.12,18.38 66.34,18.38 66.37,18.4 66.98,18.4 67,18.38 73,18.38 | 60.5,19 59.12,17.62 51.01,17.62 48.24,14.85 48.2,14.85 47.77,14.43 47.77,14.38 44.69,11.3 44.69,11.19 | v46.12,9.75 44.69,11.19 | 44.69,11.19 44.59,11.19 43.66,10.25 42.73,10.25 41.07,11.9 33.21,11.9 32.61,12.5 v29.12,12.5 29,12.38 27.12,12.38 | 27.12,12.38 v21.88,17.62 | 27.12,12.38 18.14,12.38 17.61,12.9 17.6,12.9 v17.38,13.12 | v25.96,21.77 25.96,22.48 25.98,22.49 25.98,23.09 25.96,23.1 25.96,28.46 26.77,29.27 26.8,29.27 27.23,29.7 27.23,29.73 v27.88,30.38 | v27.14,34.73 25.35,34.73 v25.25,34.62 | JTAG.2 42.62,20 v46.25,16.38 | 73,18.38 73.12,18.38 73.25,18.5 v73.25,20.8 73.75,21.3 73.75,24.77 MAG.2 73.7,24.95 73.7,26 74.52,26.82 81.61,26.82 82.12,26.3 82.12,22.15 81.72,21.75 v81.62,21.75 | 73,18.38 73.25,18.12 73.25,12.83 73.74,12.34 76.5,12.34 77.55,11.29 77.55,9.81 78,9.36 v78,8.88 | BSK4.1 64.73,85.38 77.9,85.38 82.62,80.65 82.62,75.12 | 82.62,75.12 v84.12,75.12 | 82.62,75.12 v82.12,74.62 | v17.27,56.85 17.27,57.98 11.14,64.11 v11.14,67.26 | v14.55,50.47 14,50.47 12.03,48.5 JP1.1

## Text on the board
tPlace: SDATM | SCLTM
tNames: BKU "Концерн ИТС"